# Altium schematic sheet User_Interface.SchDoc: AusBubble : Logic & RF : User Interface
size A4; DrawnBy: WR, ND; DocumentNumber: 6; Revision: A; SheetNumber: 6; SheetTotal: 6
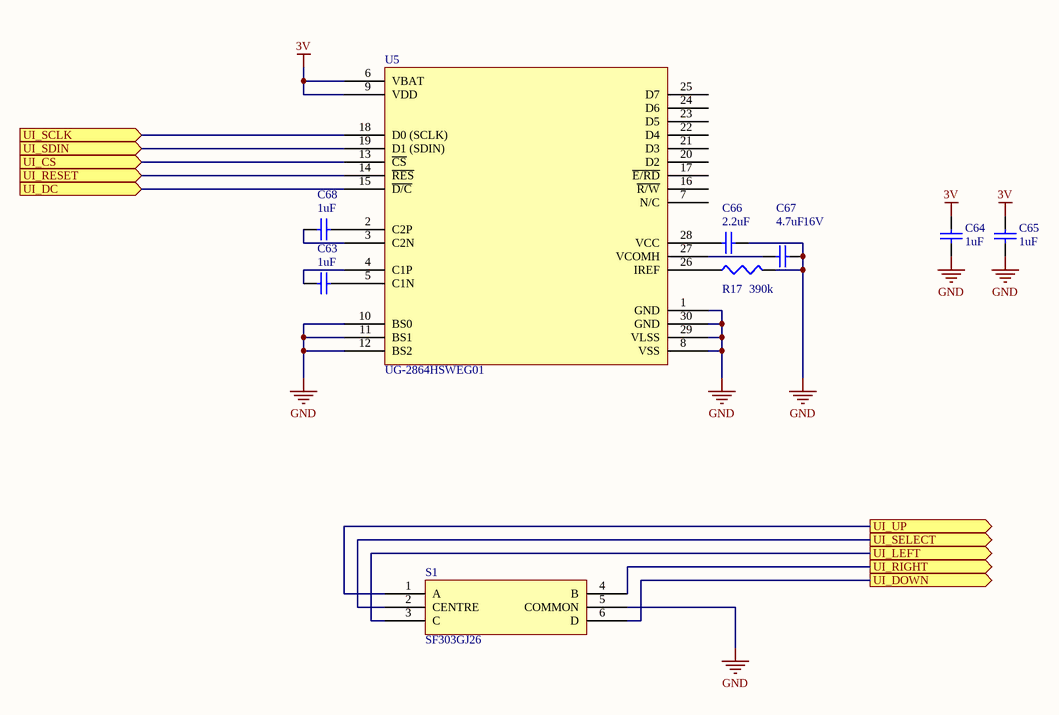
[diagram p0: User_Interface.SchDoc]

## Parts
C63  value 1uF  [1608[0603]]  (hidden comment: Cap Semi)
C64  value 1uF  [1608[0603]]  (hidden comment: Cap Semi)
C65  value 1uF  [1608[0603]]  (hidden comment: Cap Semi)
C66  value 2.2uF  [1608[0603]]  (hidden comment: Cap Semi)
C67  value 4.7uF  Voltage: 16V  [1608[0603]]  (hidden comment: Cap Semi)
C68  value 1uF  [1608[0603]]  (hidden comment: Cap Semi)
R17  value 390k  [J1-0603]  (hidden comment: Res3)
S1  SF303GJ26  [SF303GJ26]
U5  UG-2864HSWEG01  [UG-2864HSWEG01]

## Ports
UI_CS (in), UI_DC (in), UI_DOWN (out), UI_LEFT (out), UI_RESET (in), UI_RIGHT (out), UI_SCLK (in), UI_SDIN (in), UI_SELECT (out), UI_UP (out)

## Nets
3V: C64.2 C65.2 U5.6(VBAT) U5.9(VDD)
GND: C64.1 C65.1 C66.1 C67.1 R17.2 S1.5(COMMON) U5.1(GND) U5.8(VSS) U5.10(BS0) U5.11(BS1) U5.12(BS2) U5.29(VLSS) U5.30(GND)
UI_CS: U5.13(~{CS}) ; port UI_CS
UI_DC: U5.15(~{D/C}) ; port UI_DC
UI_DOWN: S1.6(D) ; port UI_DOWN
UI_LEFT: S1.3(C) ; port UI_LEFT
UI_RESET: U5.14(~{RES}) ; port UI_RESET
UI_RIGHT: S1.4(B) ; port UI_RIGHT
UI_SCLK: U5.18(D0_(SCLK)) ; port UI_SCLK
UI_SDIN: U5.19(D1_(SDIN)) ; port UI_SDIN
UI_SELECT: S1.2(CENTRE) ; port UI_SELECT
UI_UP: S1.1(A) ; port UI_UP
NetC63_1: C63.1 U5.5(C1N)
NetC63_2: C63.2 U5.4(C1P)
NetC66_2: C66.2 U5.28(VCC)
NetC67_2: C67.2 U5.27(VCOMH)
NetC68_1: C68.1 U5.2(C2P)
NetC68_2: C68.2 U5.3(C2N)
NetR17_1: R17.1 U5.26(IREF)

Not connected (* = marked no-connect by the designer): U5 7(N/C) 16(~{R/W}) 17(~{E/RD}) 20(D2) 21(D3) 22(D4) 23(D5) 24(D6) 25(D7)

## Library data of the parts
C63-C68 = Cap Semi: Capacitor (Semiconductor SIM Model); Published: 8-Jun-2000; LatestRevisionDate: 29-May-2009; LatestRevisionNote: IPC-7351 Footprint Added.; PackageReference: C1206; Publisher: Altium Limited; PackageDescription: Chip Capacitor
R17 = Res3: Resistor; Published: 8-Jun-2000; LatestRevisionDate: 29-May-2009; LatestRevisionNote: IPC-7351 Footprint Added.; PackageReference: J1-0603; Publisher: Altium Limited; PackageDescription: Chip Resistor
S1 = SF303GJ26: 5 Way Tactile Switch
U5 = UG-2864HSWEG01: 128x64 Bi-Colour OLED module